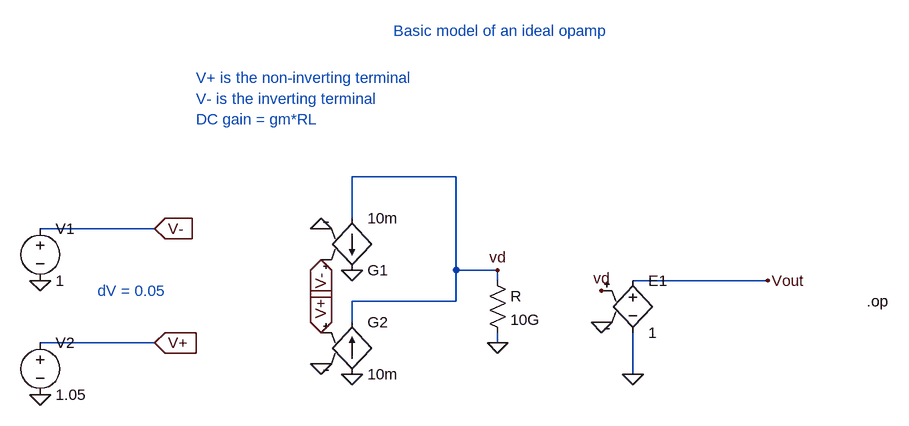
[diagram p0: schematic basic_opamp_model.asc]
basic_opamp_model.asc, the LTspice schematic file:
Version 4
SHEET 1 1544 680
WIRE 368 -144 208 -144
WIRE 208 -80 208 -144
WIRE -96 -64 -272 -64
WIRE 368 0 368 -144
WIRE 432 0 368 0
WIRE 432 16 432 0
WIRE 848 16 640 16
WIRE 368 48 368 0
WIRE 368 48 208 48
WIRE 208 80 208 48
WIRE -96 112 -272 112
WIRE 432 112 432 96
WIRE 640 160 640 96
FLAG 160 -64 0
FLAG 160 144 0
FLAG 208 0 0
FLAG 208 160 0
FLAG -96 -64 V-
IOPIN -96 -64 In
FLAG 160 -16 V-
IOPIN 160 -16 In
FLAG -96 112 V+
IOPIN -96 112 In
FLAG 160 96 V+
IOPIN 160 96 In
FLAG 848 16 Vout
FLAG -272 16 0
FLAG -272 192 0
FLAG 432 112 0
FLAG 640 160 0
FLAG 592 80 0
FLAG 432 0 vd
FLAG 592 32 vd
SYMBOL g 208 64 R0
SYMATTR InstName G2
SYMATTR Value 10m
SYMBOL g 208 16 M180
SYMATTR InstName G1
SYMATTR Value 10m
SYMBOL voltage -272 -80 R0
WINDOW 123 0 0 Left 0
WINDOW 39 0 0 Left 0
SYMATTR InstName V1
SYMATTR Value 1
SYMBOL voltage -272 96 R0
WINDOW 123 0 0 Left 0
WINDOW 39 0 0 Left 0
SYMATTR InstName V2
SYMATTR Value 1.05
SYMBOL res 416 0 R0
SYMATTR InstName R
SYMATTR Value 10G
SYMBOL e 640 0 R0
SYMATTR InstName E1
SYMATTR Value 1
TEXT 1000 48 Left 2 !.op
TEXT 272 -368 Left 2 ;Basic model of an ideal opamp
TEXT -32 -296 Left 2 ;V+ is the non-inverting terminal
TEXT -32 -264 Left 2 ;V- is the inverting terminal
TEXT -32 -232 Left 2 ;DC gain = gm*RL
TEXT -184 32 Left 2 ;dV = 0.05

The netlist it stands for:
* basic_opamp_model.asc
G2 0 vd V+ 0 10m
G1 vd 0 V- 0 10m
V1 V- 0 1
V2 V+ 0 1.05
R vd 0 10G
E1 Vout 0 vd 0 1
.op
* Basic model of an ideal opamp
* V+ is the non-inverting terminal
* V- is the inverting terminal
* DC gain = gm*RL
* dV = 0.05
.backanno
.end